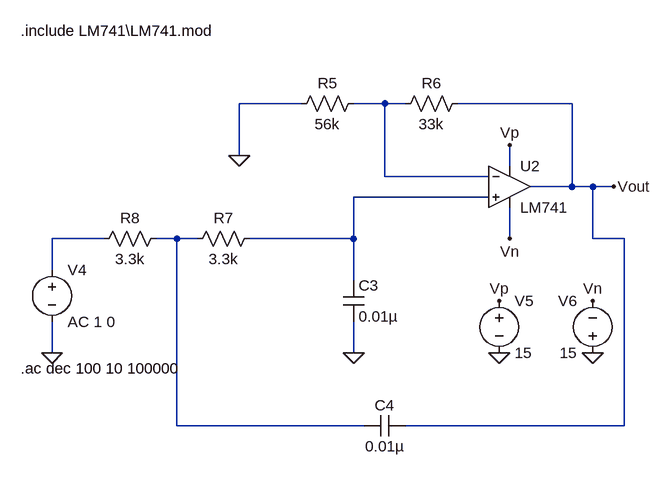
[diagram p0: schematic Draft1.asc]
Draft1.asc, the LTspice schematic file:
Version 4
SHEET 1 880 680
WIRE 128 -800 32 -800
WIRE 256 -800 208 -800
WIRE 288 -800 256 -800
WIRE 544 -800 368 -800
WIRE 32 -720 32 -800
WIRE 448 -704 448 -736
WIRE 256 -688 256 -800
WIRE 416 -688 256 -688
WIRE 544 -672 544 -800
WIRE 544 -672 480 -672
WIRE 576 -672 544 -672
WIRE 608 -672 576 -672
WIRE 416 -656 208 -656
WIRE -176 -592 -256 -592
WIRE -64 -592 -96 -592
WIRE -32 -592 -64 -592
WIRE 208 -592 208 -656
WIRE 208 -592 48 -592
WIRE 448 -592 448 -640
WIRE 576 -592 576 -672
WIRE 624 -592 576 -592
WIRE -256 -544 -256 -592
WIRE 208 -528 208 -592
WIRE -256 -416 -256 -464
WIRE 208 -416 208 -464
WIRE -64 -304 -64 -592
WIRE 224 -304 -64 -304
WIRE 624 -304 624 -592
WIRE 624 -304 288 -304
FLAG 208 -416 0
FLAG -256 -416 0
FLAG 32 -720 0
FLAG 608 -672 Vout
FLAG 448 -736 Vp
FLAG 448 -592 Vn
FLAG 432 -496 Vp
FLAG 576 -496 Vn
FLAG 432 -416 0
FLAG 576 -416 0
SYMBOL res 224 -816 R90
WINDOW 0 0 56 VBottom 2
WINDOW 3 32 56 VTop 2
SYMATTR InstName R5
SYMATTR Value 56k
SYMBOL res 384 -816 R90
WINDOW 0 0 56 VBottom 2
WINDOW 3 32 56 VTop 2
SYMATTR InstName R6
SYMATTR Value 33k
SYMBOL res 64 -608 R90
WINDOW 0 0 56 VBottom 2
WINDOW 3 32 56 VTop 2
SYMATTR InstName R7
SYMATTR Value 3.3k
SYMBOL cap 192 -528 R0
SYMATTR InstName C3
SYMATTR Value 0.01µ
SYMBOL voltage -256 -560 R0
WINDOW 123 0 0 Left 0
WINDOW 39 0 0 Left 0
SYMATTR InstName V4
SYMATTR Value AC 1 0
SYMBOL OpAmps\\opamp2 448 -736 R0
SYMATTR InstName U2
SYMATTR Value LM741
SYMBOL voltage 432 -512 R0
WINDOW 123 0 0 Left 0
WINDOW 39 0 0 Left 0
SYMATTR InstName V5
SYMATTR Value 15
SYMBOL voltage 576 -400 R180
WINDOW 0 24 96 Left 2
WINDOW 3 24 16 Left 2
WINDOW 123 0 0 Left 0
WINDOW 39 0 0 Left 0
SYMATTR InstName V6
SYMATTR Value 15
SYMBOL res -80 -608 R90
WINDOW 0 0 56 VBottom 2
WINDOW 3 32 56 VTop 2
SYMATTR InstName R8
SYMATTR Value 3.3k
SYMBOL cap 288 -320 R90
WINDOW 0 0 32 VBottom 2
WINDOW 3 32 32 VTop 2
SYMATTR InstName C4
SYMATTR Value 0.01µ
TEXT -304 -912 Left 2 !.include LM741\\LM741.mod
TEXT -304 -392 Left 2 !.ac dec 100 10 100000

The netlist it stands for:
* Draft1.asc
R5 N001 0 56k
R6 Vout N001 33k
R7 N002 N004 3.3k
C3 N002 0 0.01µ
V4 N003 0 AC 1 0
XU2 N002 N001 Vp Vn Vout LM741  ; pins In+ In- V+ V- OUT
V5 Vp 0 15
V6 0 Vn 15
R8 N004 N003 3.3k
C4 Vout N004 0.01µ
.include LM741\LM741.mod
.ac dec 100 10 100000
.backanno
.end